# Altium schematic sheet MCU.SchDoc
size A4
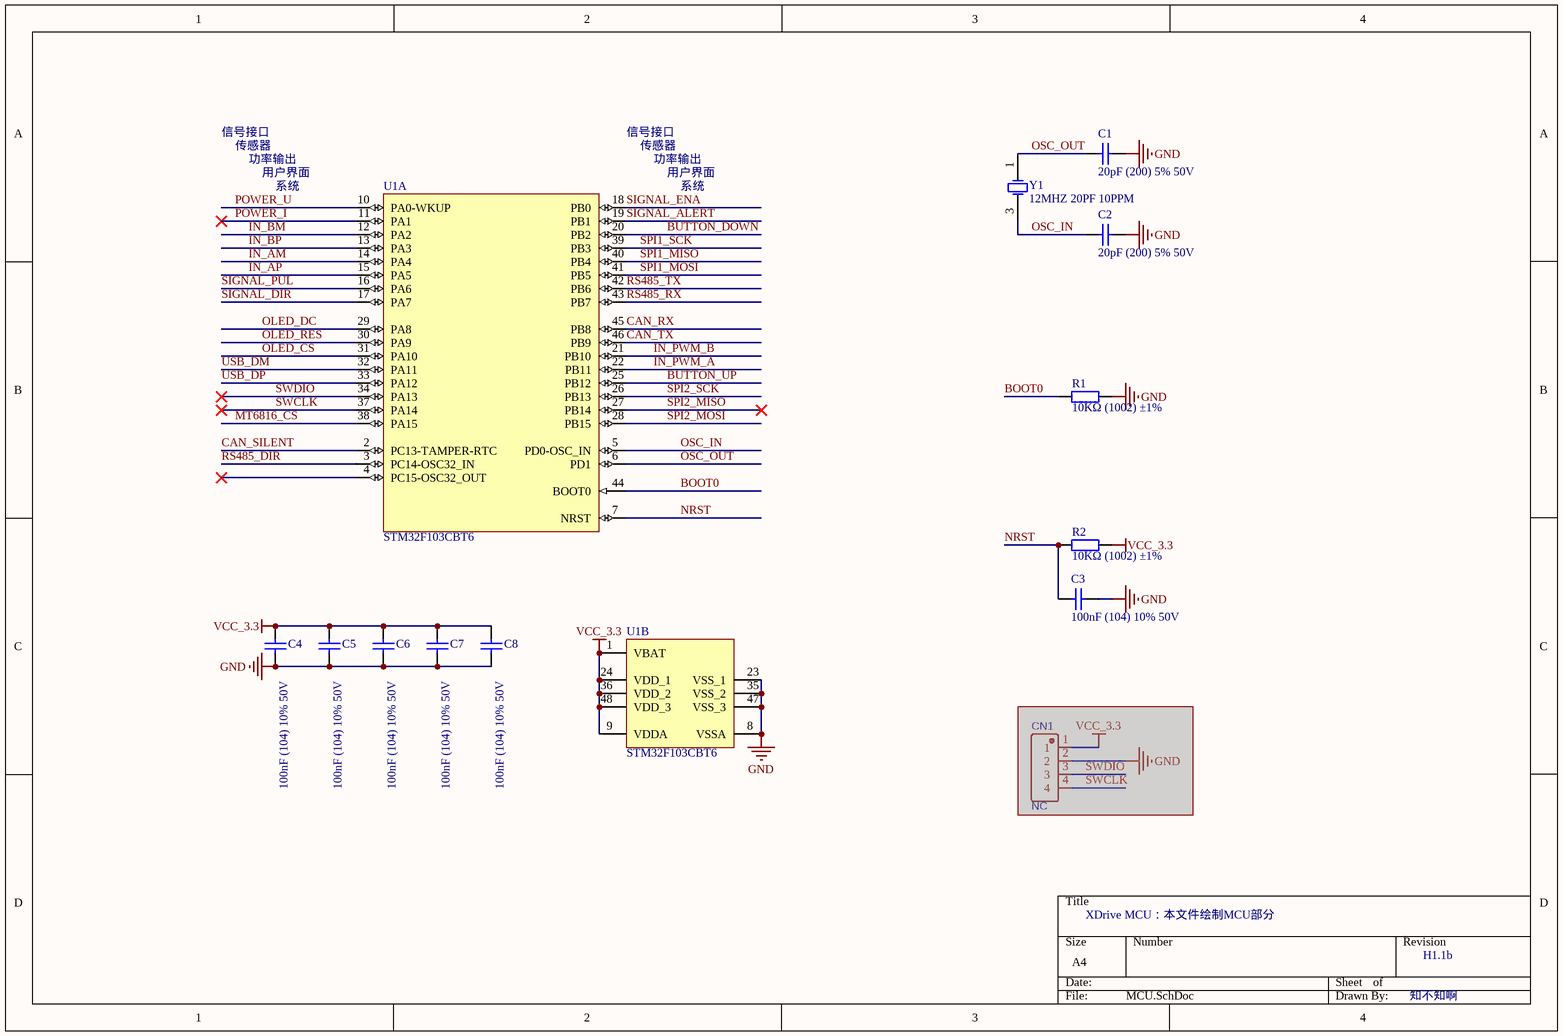
[diagram p0: MCU.SchDoc]

## Parts
C1  20pF (200) 5% 50V  [0603_C]
C2  20pF (200) 5% 50V  [0603_C]
C3  100nF (104) 10% 50V  [0603_C]
C4  100nF (104) 10% 50V  [0603_C]
C5  100nF (104) 10% 50V  [0603_C]
C6  100nF (104) 10% 50V  [0603_C]
C7  100nF (104) 10% 50V  [0603_C]
C8  100nF (104) 10% 50V  [0603_C]
CN1  NC  [HDR2.54-LI-4P]  (masked out: inside a compile mask, not in the netlist)
R1  10KΩ (1002) ±1%  [0603_R]
R2  10KΩ (1002) ±1%  [0603_R]
U1  STM32F103CBT6  [LQFP48_N]  (parts A,B of 2)
Y1  12MHZ 20PF 10PPM  [SMD-3225_4P]

## Nets
GND: C1.1 C2.1 C3.2 C4.1 C5.1 C6.1 C7.1 C8.1 R1.2 U1.8(VSSA) U1.23(VSS_1) U1.35(VSS_2) U1.47(VSS_3)
VCC_3.3: C4.2 C5.2 C6.2 C7.2 C8.2 R2.2 U1.1(VBAT) U1.9(VDDA) U1.24(VDD_1) U1.36(VDD_2) U1.48(VDD_3)
BOOT0: R1.1 U1.44(BOOT0)
BUTTON_DOWN: U1.20(PB2)
BUTTON_UP: U1.25(PB12)
CAN_RX: U1.45(PB8)
CAN_SILENT: U1.2(PC13-TAMPER-RTC)
CAN_TX: U1.46(PB9)
IN_AM: U1.14(PA4)
IN_AP: U1.15(PA5)
IN_BM: U1.12(PA2)
IN_BP: U1.13(PA3)
IN_PWM_A: U1.22(PB11)
IN_PWM_B: U1.21(PB10)
MT6816_CS: U1.38(PA15)
NRST: C3.1 R2.1 U1.7(NRST)
OLED_CS: U1.31(PA10)
OLED_DC: U1.29(PA8)
OLED_RES: U1.30(PA9)
OSC_IN: C2.2 U1.5(PD0-OSC_IN) Y1.3(OSC2)
OSC_OUT: C1.2 U1.6(PD1) Y1.1(OSC1)
POWER_I: U1.11(PA1)
POWER_U: U1.10(PA0-WKUP)
RS485_DIR: U1.3(PC14-OSC32_IN)
RS485_RX: U1.43(PB7)
RS485_TX: U1.42(PB6)
SIGNAL_ALERT: U1.19(PB1)
SIGNAL_DIR: U1.17(PA7)
SIGNAL_ENA: U1.18(PB0)
SIGNAL_PUL: U1.16(PA6)
SPI1_MISO: U1.40(PB4)
SPI1_MOSI: U1.41(PB5)
SPI1_SCK: U1.39(PB3)
SPI2_MISO: U1.27(PB14)
SPI2_MOSI: U1.28(PB15)
SPI2_SCK: U1.26(PB13)
SWCLK: U1.37(PA14)
SWDIO: U1.34(PA13)
USB_DM: U1.32(PA11)
USB_DP: U1.33(PA12)

Not connected (* = marked no-connect by the designer): U1 4(PC15-OSC32_OUT)*

## Notes on the sheet
- 信号接口
- 传感器
- 功率输出
- 用户界面
- 系统
- XDrive MCU：本文件绘制MCU部分
- H1.1b
- 知不知啊

## Library data of the parts
C1 C2 = 0603 20pF (200) 5% 50V: 贴片电容; ComponentLink1Description: 供应商链接; ComponentLink1URL: http://www.szlcsc.com/product/details_2000.html; Package: 0603; Supplier: LC; SuppliersPartNumber: C1648
C3-C8 = 0603 100nF (104) 10% 50V: 贴片电容; ComponentLink1Description: 供应商链接; ComponentLink1URL: http://www.szlcsc.com/product/details_15331.html; Package: 0603; Supplier: LC; SuppliersPartNumber: C14663
CN1 = A2005HWV-4P: 单排插针-2.54mm; BOM_Manufacturer: Changjiang Connectors; Contributor: LCSC; BOM_Supplier: LCSC; BOM_Supplier Part: C225282; BOM_Manufacturer Part: A2005HWV-4P; spicePre: C; spiceSymbolName: A2005HWV-4P
R1 R2 = 0603 10KΩ (1002) 1%: 贴片电阻; ComponentLink1Description: 供应商链接; ComponentLink1URL: http://www.szlcsc.com/product/details_26547.html; Package: 0603; Supplier: LC; SuppliersPartNumber: C25804
U1 = STM32F103CBT6: STM32 ARM-based 32-bit MCU Performance Line with 128 kB Flash, 20 kB Internal RAM, -40 to +85癈 Temperature, 48-Pin LQFP, Tray; DatasheetVersion: rev13.0, Apr-2011; PackageVersion: rev13, Apr-2011; PackageReference: LQFP48; PackageDescription: 48-Pin Low-Profile Quad Flat Pack, 7 x 7 mm Body, 0.5 mm Pitch (LQFP48); ComponentLink1Description: Manufacturer URL; ComponentLink1URL: http://www.st.com/; ComponentLink2Description: STM32F103 Datasheet; ComponentLink2URL: http://www.st.com/internet/com/TECHNICAL_RESOURCES/TECHNICAL_LITERATURE/DATASHEET/CD00161566.pdf; ComponentLink3Description: STM32 Family Web Page; ComponentLink3URL: www.st.com/stm32
Y1 = SMD-3225_4P  12MHZ 20PF 10PPM: 贴片晶振; ComponentLink1Description: 供应商链接; ComponentLink1URL: http://www.szlcsc.com/product/details_9522.html; Package: SMD-3225_4P; Supplier: LC; SuppliersPartNumber: C9002